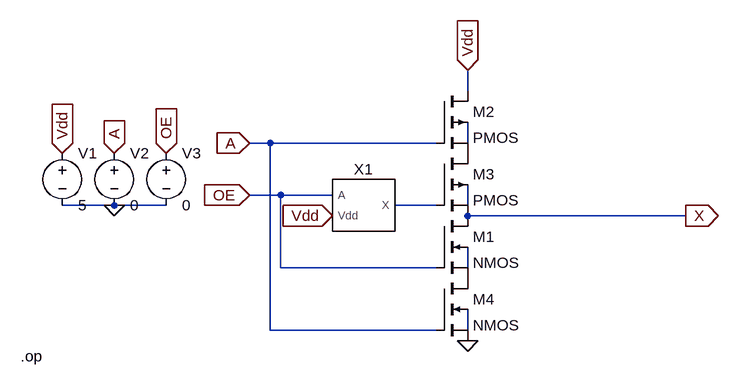
[diagram p0: schematic tri_state_inv.asc]
tri_state_inv.asc, the LTspice schematic file:
Version 4.1
SHEET 1 880 680
WIRE 224 -80 224 -112
WIRE -80 0 -112 0
WIRE 176 0 -80 0
WIRE 224 0 224 -32
WIRE -64 80 -112 80
WIRE 16 80 -64 80
WIRE -320 96 -400 96
WIRE -240 96 -320 96
WIRE 176 96 112 96
WIRE 224 96 224 64
WIRE 560 112 224 112
WIRE -64 192 -64 80
WIRE 176 192 -64 192
WIRE 224 192 224 160
WIRE -80 288 -80 0
WIRE 176 288 -80 288
WIRE 224 288 224 256
FLAG 224 304 0
FLAG 224 -112 Vdd
IOPIN 224 -112 In
FLAG 16 112 Vdd
IOPIN 16 112 In
FLAG -112 0 A
IOPIN -112 0 In
FLAG -112 80 OE
IOPIN -112 80 In
FLAG 560 112 X
IOPIN 560 112 Out
FLAG -400 16 Vdd
IOPIN -400 16 In
FLAG -320 16 A
IOPIN -320 16 In
FLAG -240 16 OE
IOPIN -240 16 In
FLAG -320 96 0
DATAFLAG 544 112 ""
SYMBOL nmos4 176 112 R0
SYMATTR InstName M1
SYMBOL pmos4 176 16 R0
SYMATTR InstName M3
SYMBOL voltage -400 0 R0
WINDOW 123 0 0 Left 0
WINDOW 39 0 0 Left 0
SYMATTR InstName V1
SYMATTR Value 5
SYMBOL voltage -320 0 R0
WINDOW 123 0 0 Left 0
WINDOW 39 0 0 Left 0
SYMATTR InstName V2
SYMATTR Value 0
SYMBOL voltage -240 0 R0
WINDOW 123 0 0 Left 0
WINDOW 39 0 0 Left 0
SYMATTR InstName V3
SYMATTR Value 0
SYMBOL CMOS-Logic-Gates\\basic\ gates\\not_gate 64 96 R0
SYMATTR InstName X1
SYMBOL pmos4 176 -80 R0
SYMATTR InstName M2
SYMBOL nmos4 176 208 R0
SYMATTR InstName M4
TEXT -464 328 Left 2 !.op

The netlist it stands for:
* tri_state_inv.asc
M1 X OE P001 N004 NMOS
M3 P002 N002 X N003 PMOS
V1 Vdd 0 5
V2 A 0 0
V3 OE 0 0
X§X1 OE Vdd N002 not_gate  ; pins A Vdd X
M2 Vdd A P002 N001 PMOS
M4 P001 A 0 N005 NMOS
.model NMOS NMOS
.model PMOS PMOS
.lib standard.mos
.op
.backanno
.end